# EasyEDA schematic SCH_CH1616ADX_2022-05-06.json
TITLE: CH1616ADX; REV: v1.0; Date: 2022-04-12; Sheet: 1/1; Drawn By: cccc; Company: phosense
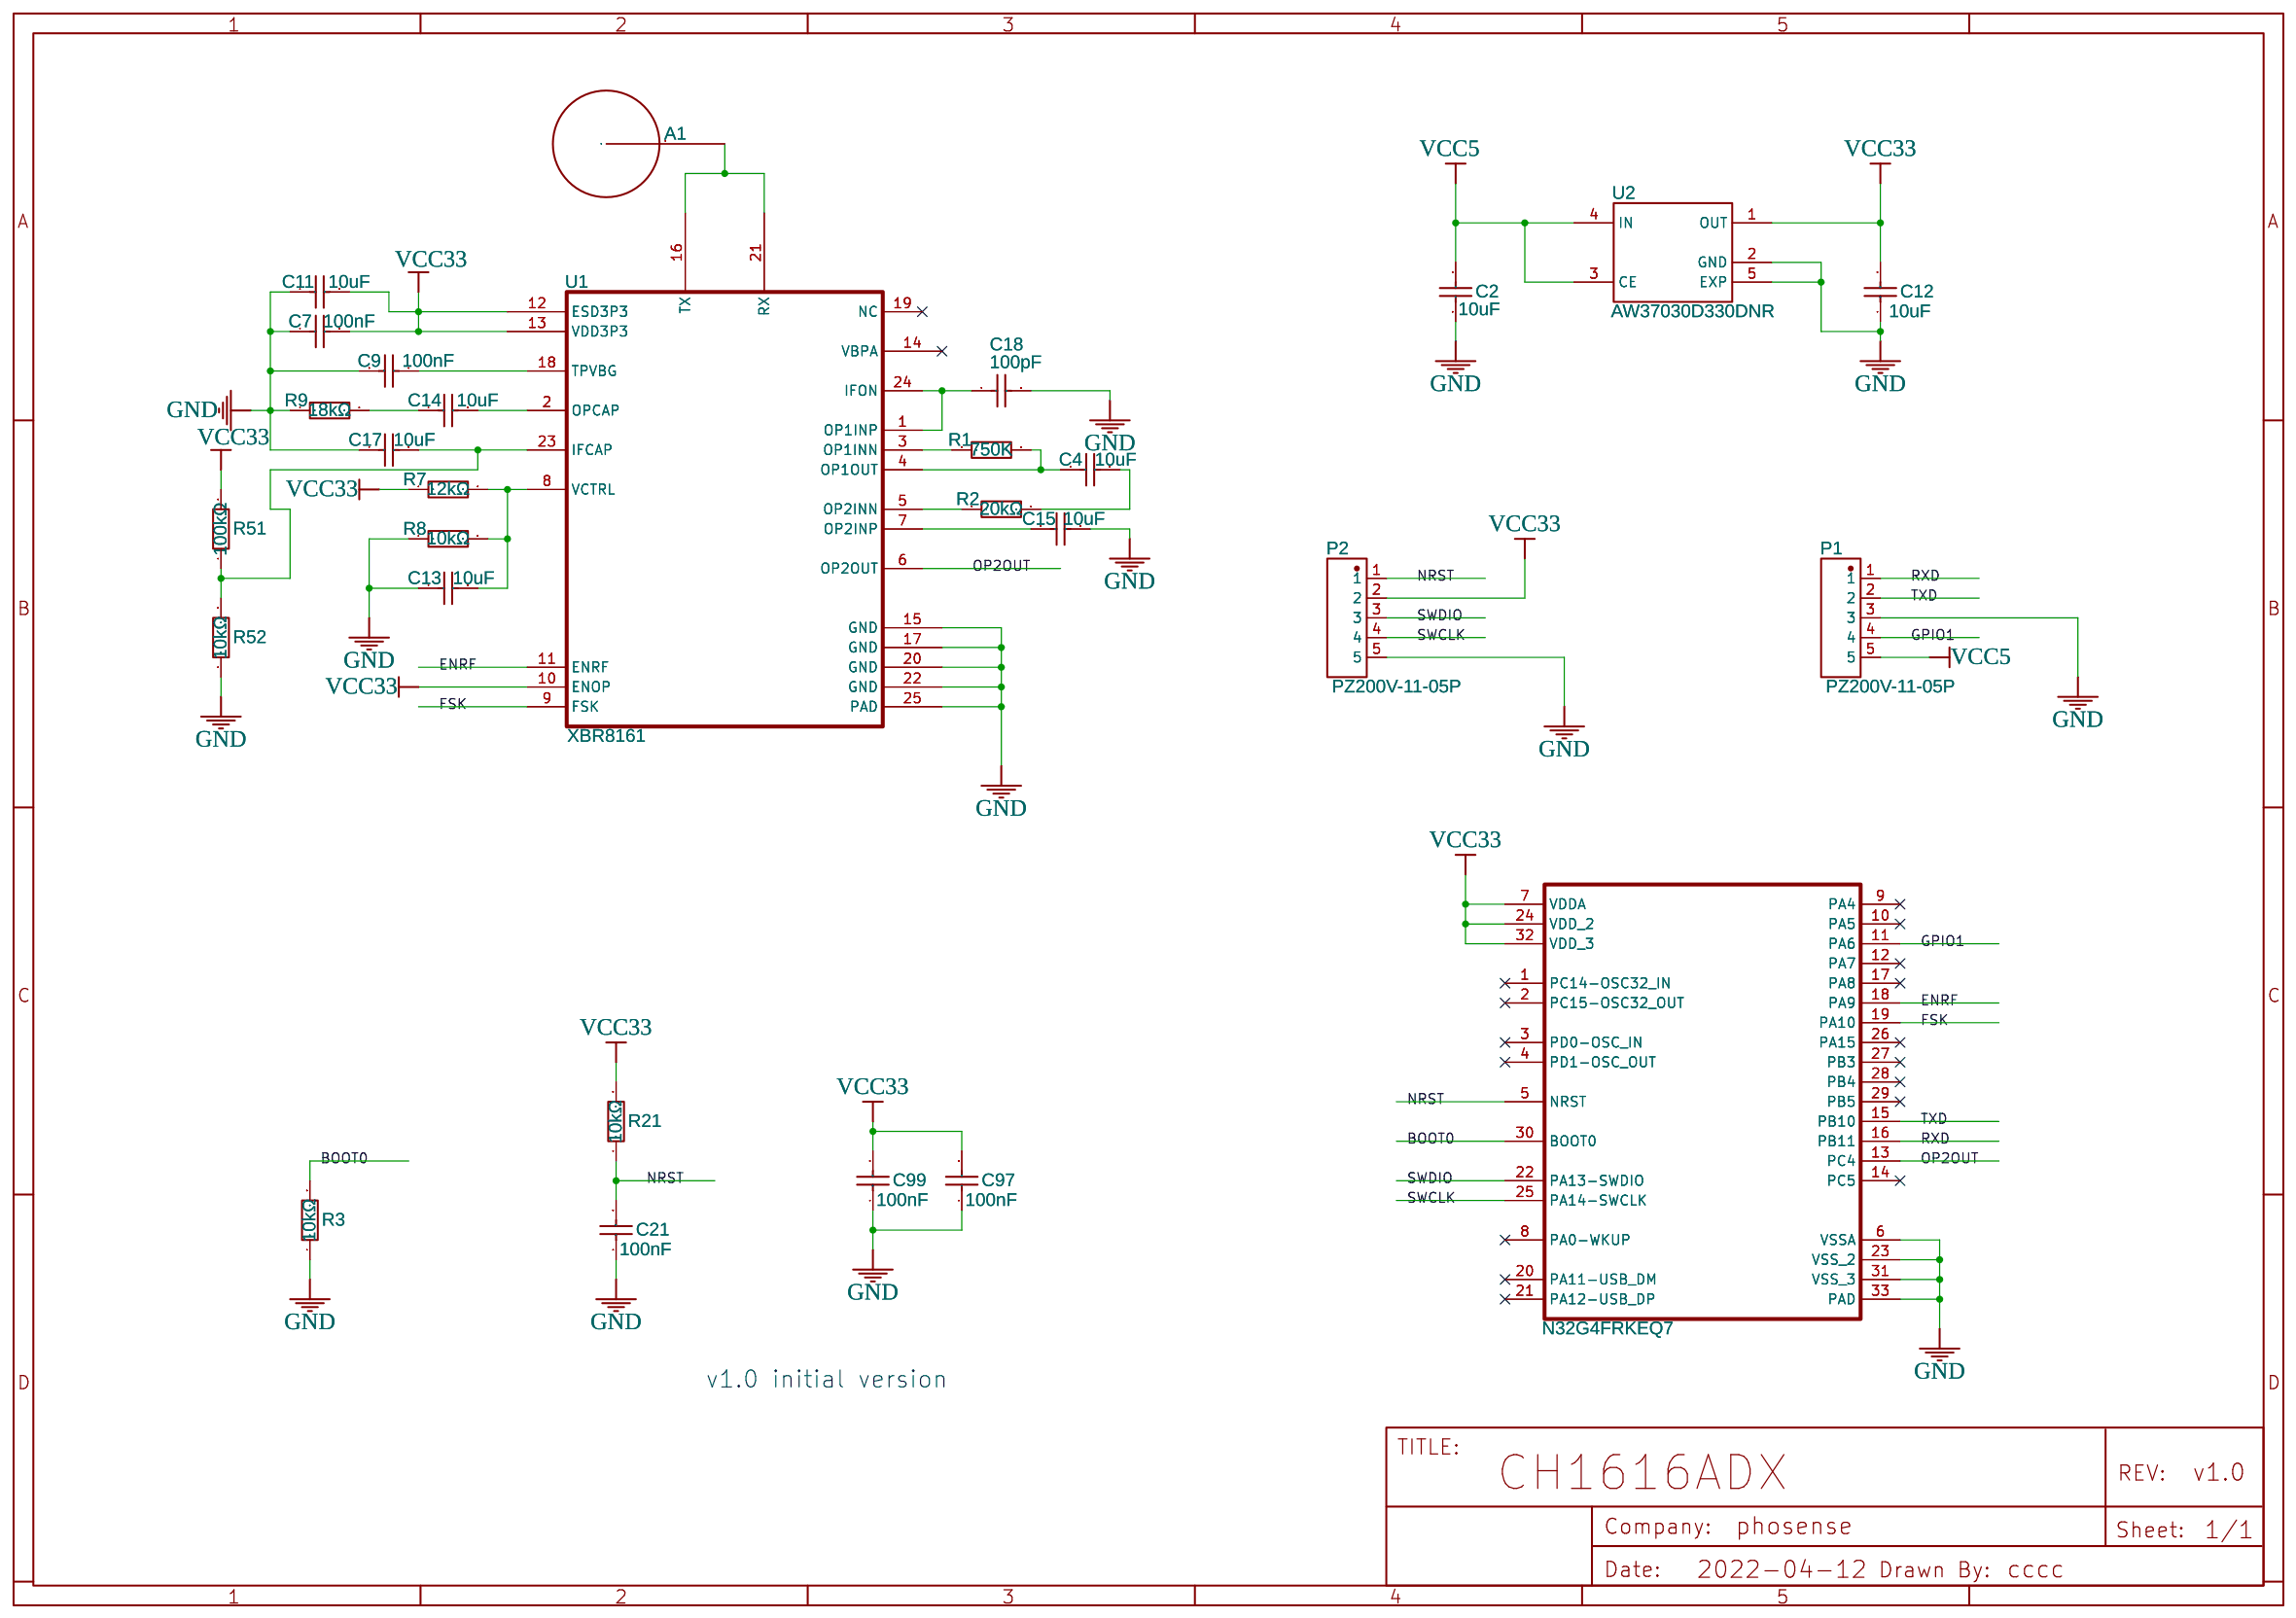
[diagram p0: schematic sheet]

## Parts
A1  ar_10.525G  [AR_10.525_1]
C2  10uF  [C0402]
C4  10uF  [C0402]
C7  100nF  [C0402_NEW]
C9  100nF  [C0402_NEW]
C11  10uF  [C0402]
C12  10uF  [C0402]
C13  10uF  [C0402]
C14  10uF  [C0402]
C15  10uF  [C0402]
C17  10uF  [C0402]
C18  100pF  [C0402]
C21  100nF  [C0402_NEW]
C97  100nF  [C0402_NEW]
C99  100nF  [C0402_NEW]
NO1  N32G4FRKEQ7
P1  PZ200V-11-05P  [HDR-TH_5P-P2.00-V-M]
P2  PZ200V-11-05P  [HDR-TH_5P-P2.00-V-M]
R1  750K  [R0402]
R2  20kΩ  [R0402]
R3  10kΩ  [R0402]
R7  12kΩ  [R0402]
R8  10kΩ  [R0402]
R9  18kΩ  [R0402]
R21  10kΩ  [R0402]
R51  100kΩ  [R0402]
R52  10kΩ  [R0402]
U1  XBR8161  [QFN24_L4.0-W4.0-P0.5-TL-EP2.45]
U2  AW37030D330DNR  [DFN_1X1_4L]

## Library data of the parts
A1 = ar_10.525G: Supplier: LCSC; Contributor: cccc_2022
C2 C4 C11-C15 C17 = CL05A106MQ5NUNC: Supplier: LCSC; Manufacturer: SAMSUNG; Supplier Part: C15525; JLCPCB Part Class: Basic Part
C7 C9 C21 C97 C99 = CL05B104KO5NNNC: Supplier: LCSC; Manufacturer: SAMSUNG; Supplier Part: C1525; JLCPCB Part Class: Basic Part
C18 = 0402CG101J500NT: Supplier: LCSC; Manufacturer: FH; Supplier Part: C1546; JLCPCB Part Class: Basic Part
NO1 = N32G4FRKEQ7: BOM_Manufacturer: NATIONS; BOM_Supplier: LCSC
P1 P2 = PZ200V-11-05P: Supplier: LCSC; Supplier Part: C541859; Manufacturer: XFCN; Contributor: LCSC; JLCPCB Part Class: Extended Part
R1 = AC0402JR-07750KL: Supplier: LCSC; Supplier Part: C227414; Manufacturer: YAGEO; Contributor: LCSC; JLCPCB Part Class: Extended Part; Resistance: 750kΩ
R2 = 0402WGF2002TCE: Supplier: LCSC; Manufacturer: UniOhm; Supplier Part: C25765; Resistance (Ohms): 20K; JLCPCB Part Class: Basic Part
R3 R8 R21 R52 = 0402WGF1002TCE: Supplier: LCSC; Manufacturer: UniOhm; Supplier Part: C25744; Resistance (Ohms): 10K; JLCPCB Part Class: Basic Part
R7 = 0402WGF1202TCE: Supplier: LCSC; Manufacturer: UniOhm; Supplier Part: C25752; Resistance (Ohms): 12K; JLCPCB Part Class: Basic Part
R9 = 0402WGF1802TCE: Supplier: LCSC; Manufacturer: UniOhm; Supplier Part: C25762; Resistance (Ohms): 18K; JLCPCB Part Class: Basic Part
R51 = 0402WGF1003TCE: Supplier: LCSC; Manufacturer: UniOhm; Supplier Part: C25741; Resistance (Ohms): 100K; JLCPCB Part Class: Basic Part
U1 = XBR8161: Manufacturer: phosense; Supplier: LCSC; link: https://www.phosense-tech.com/; Contributor: cccc_2022; Package Display: No
U2 = AW37030D330DNR: Manufacturer: awinic; Supplier: LCSC; link: cccc; Contributor: cccc_2022

## Nets
GND: C2.2 C7.1 C9.2 C11.1 C12.1 C13.1 C15.2 C17.1 C18.2 C21.1 C97.1 C99.1 NO1.6(VSSA) NO1.23(VSS_2) NO1.31(VSS_3) NO1.33(PAD) P1.3 P2.5 R3.1 R8.1 R9.1 R52.1 U1.15(GND) U1.17(GND) U1.20(GND) U1.22(GND) U1.25(PAD) U2.2(GND) U2.5(EXP)
VCC5: C2.1 P1.5 U2.3(CE) U2.4(IN)
VCC33: C7.2 C11.2 C12.2 C97.2 C99.2 NO1.7(VDDA) NO1.24(VDD_2) NO1.32(VDD_3) P2.2 R7.1 R21.2 R51.2 U1.10(ENOP) U1.12(ESD3P3) U1.13(VDD3P3) U2.1(OUT)
BOOT0: NO1.30(BOOT0) R3.2
ENRF: NO1.18(PA9) U1.11(ENRF)
FSK: NO1.19(PA10) U1.9(FSK)
GPIO1: NO1.11(PA6) P1.4
NRST: C21.2 NO1.5(NRST) P2.1 R21.1
OP2OUT: NO1.13(PC4) U1.6(OP2OUT)
RXD: NO1.16(PB11) P1.1
SWCLK: NO1.25(PA14-SWCLK) P2.4
SWDIO: NO1.22(PA13-SWDIO) P2.3
TXD: NO1.15(PB10) P1.2
Net-(A1-1): A1.1 U1.16(TX) U1.21(RX)
Net-(C4-1): C4.1 R1.2 U1.4(OP1OUT)
Net-(C4-2): C4.2 R2.2
Net-(C9-1): C9.1 U1.18(TPVBG)
Net-(C13-2): C13.2 R7.2 R8.2 U1.8(VCTRL)
Net-(C14-1): C14.1 R9.2
Net-(C14-2): C14.2 U1.2(OPCAP)
Net-(C15-1): C15.1 U1.7(OP2INP)
Net-(C17-2): C17.2 R51.1 R52.2 U1.23(IFCAP)
Net-(C18-1): C18.1 U1.1(OP1INP) U1.24(IFON)
Net-(R1-1): R1.1 U1.3(OP1INN)
Net-(R2-1): R2.1 U1.5(OP2INN)

Not connected (* = marked no-connect by the designer): NO1 1(PC14-OSC32_IN)* 2(PC15-OSC32_OUT)* 3(PD0-OSC_IN)* 4(PD1-OSC_OUT)* 8(PA0-WKUP)* 9(PA4)* 10(PA5)* 12(PA7)* 14(PC5)* 17(PA8)* 20(PA11-USB_DM)* 21(PA12-USB_DP)* 26(PA15)* 27(PB3)* 28(PB4)* 29(PB5)*; U1 14(VBPA)* 19(NC)*

## Notes on the sheet
- v1.0 initial version
